# Altium project LCC.PrjPcb
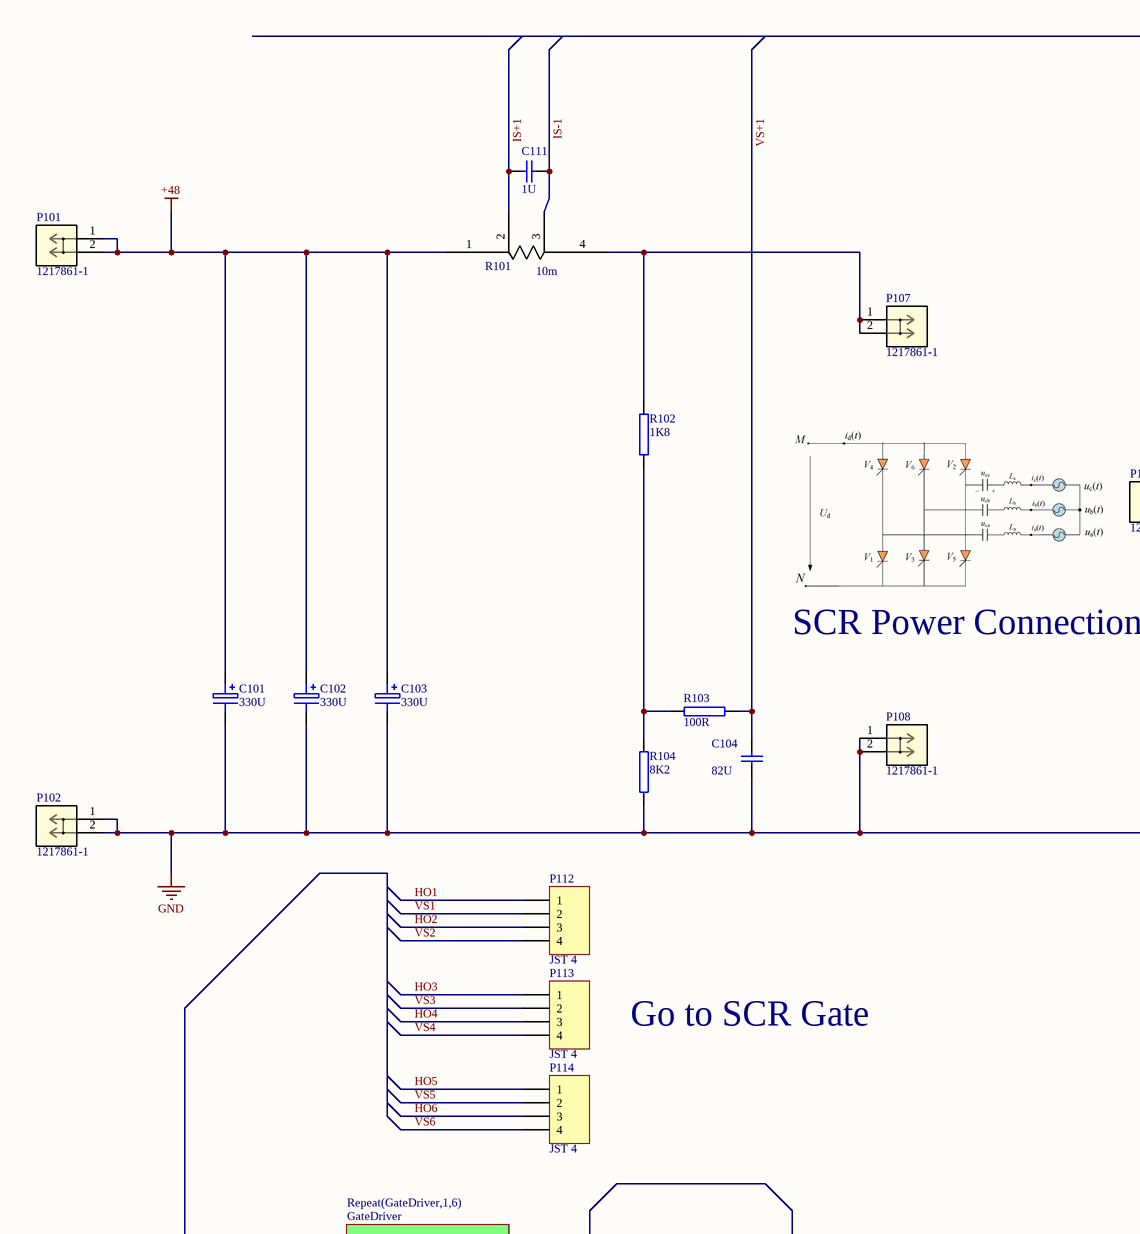
[diagram p0: main.SchDoc, top left]
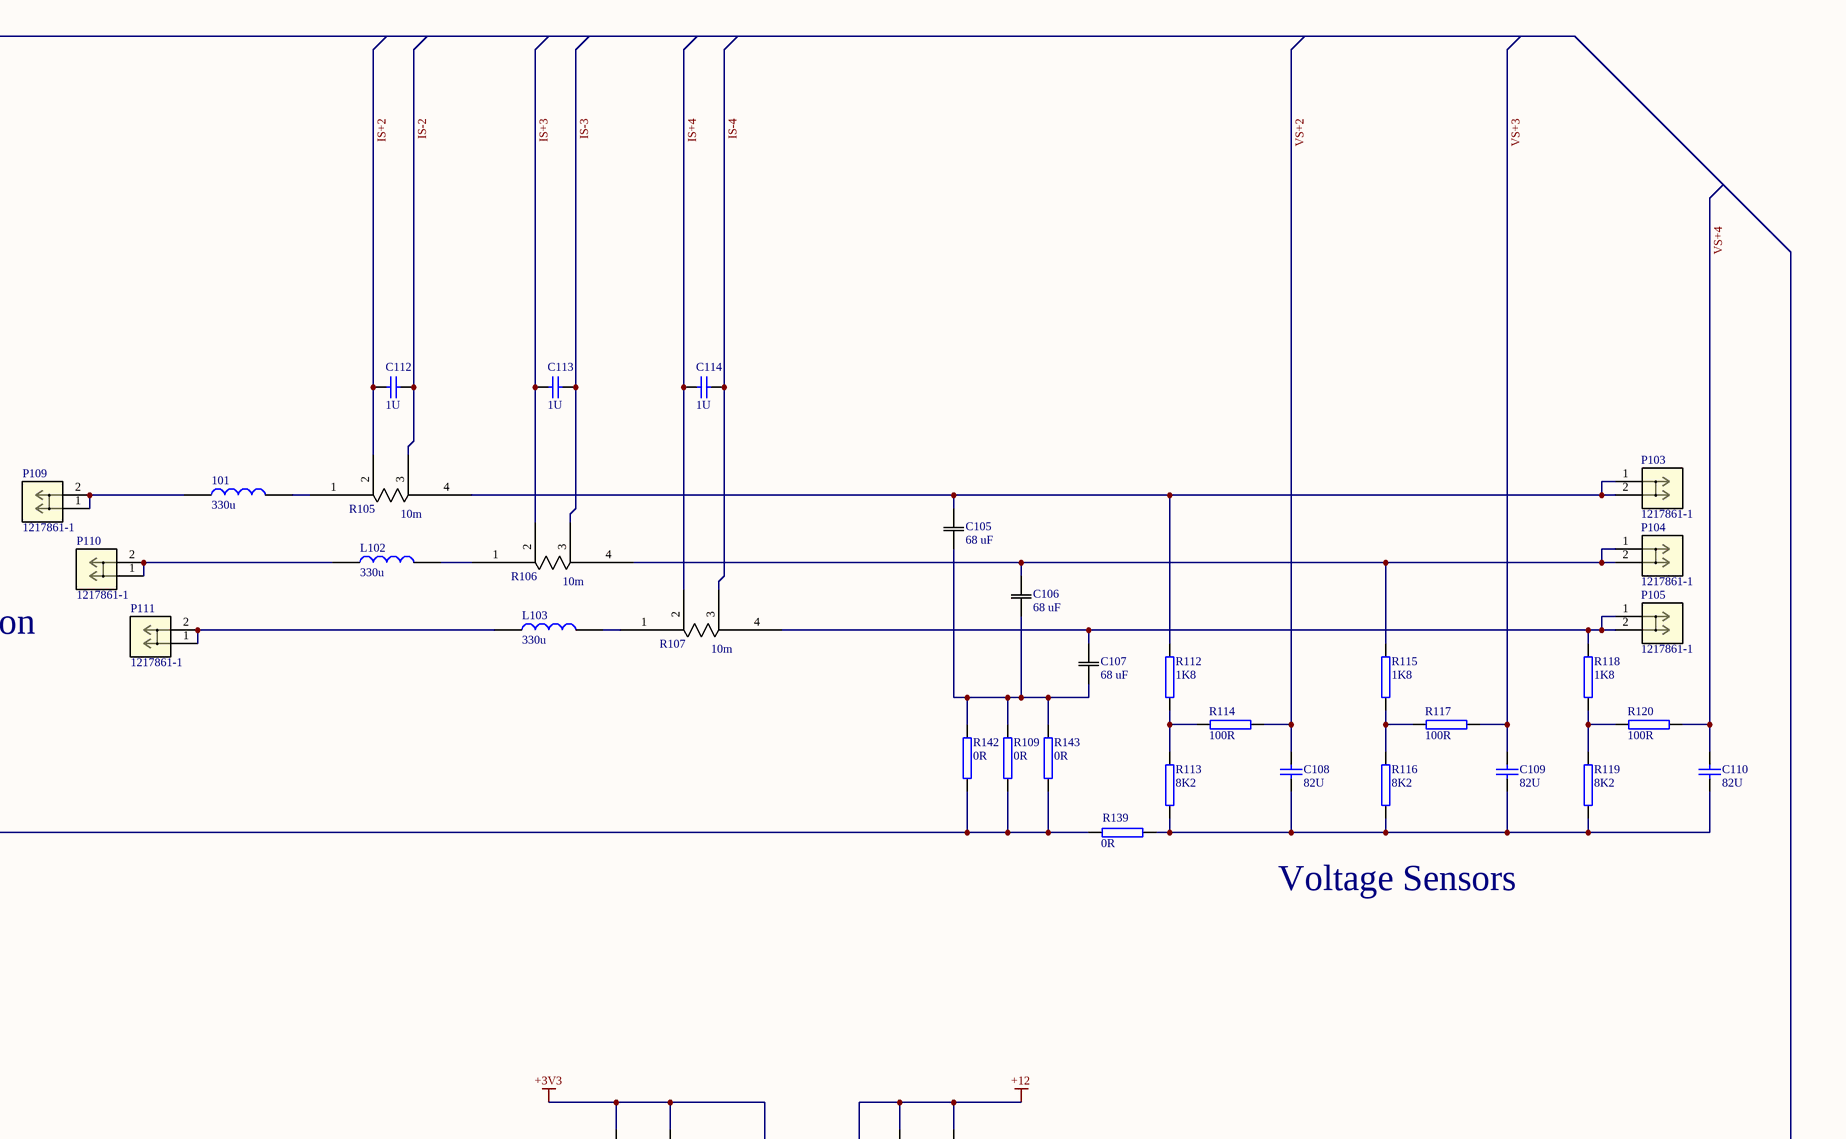
[diagram p1: main.SchDoc, top right]
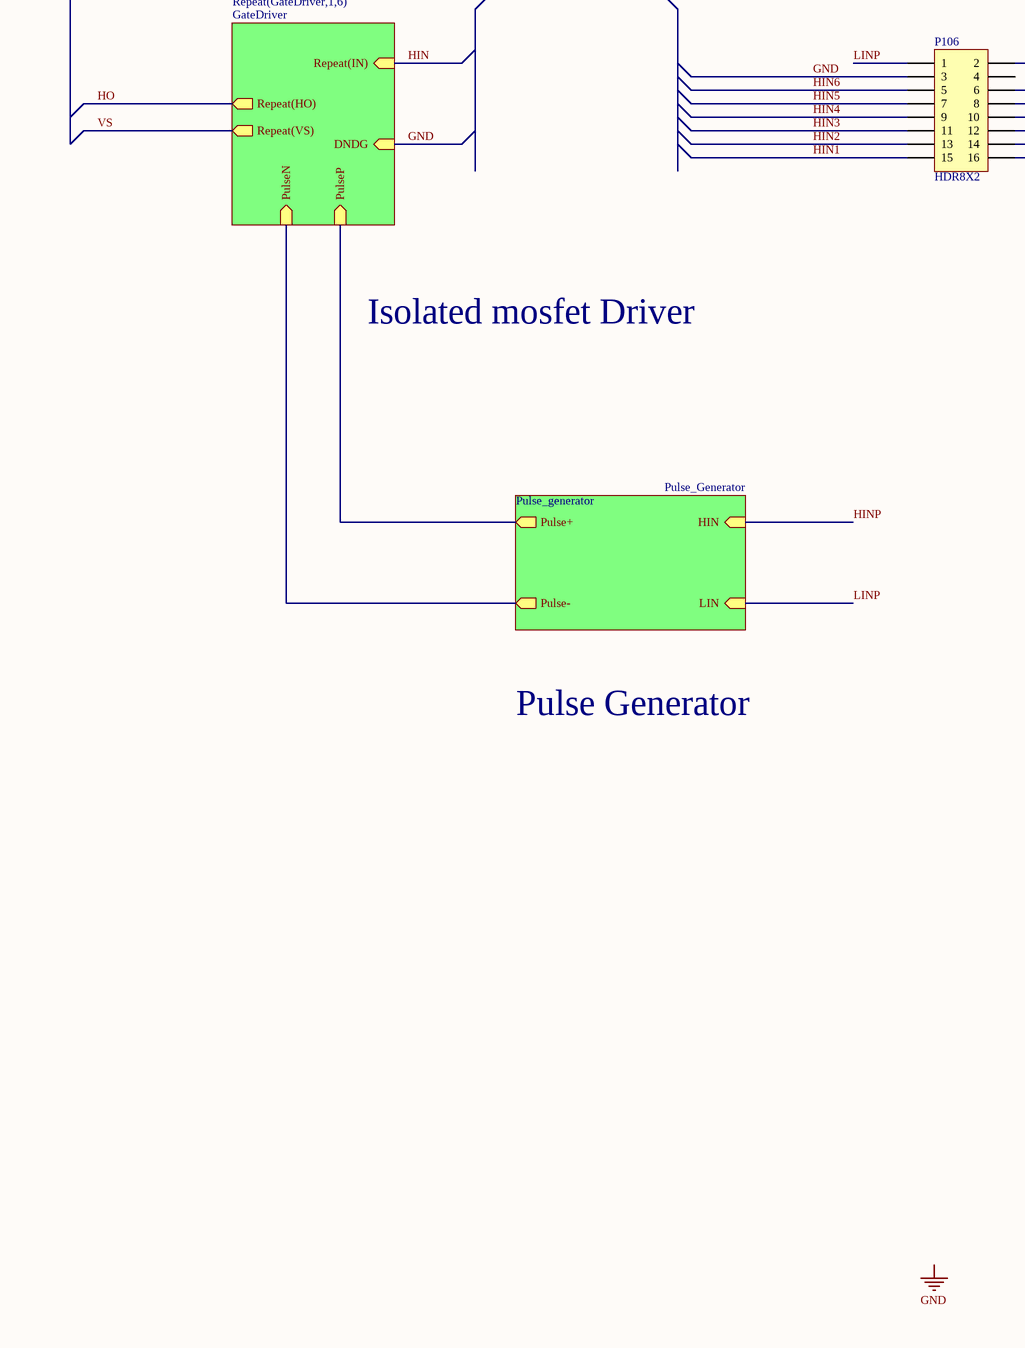
[diagram p2: main.SchDoc, bottom left]
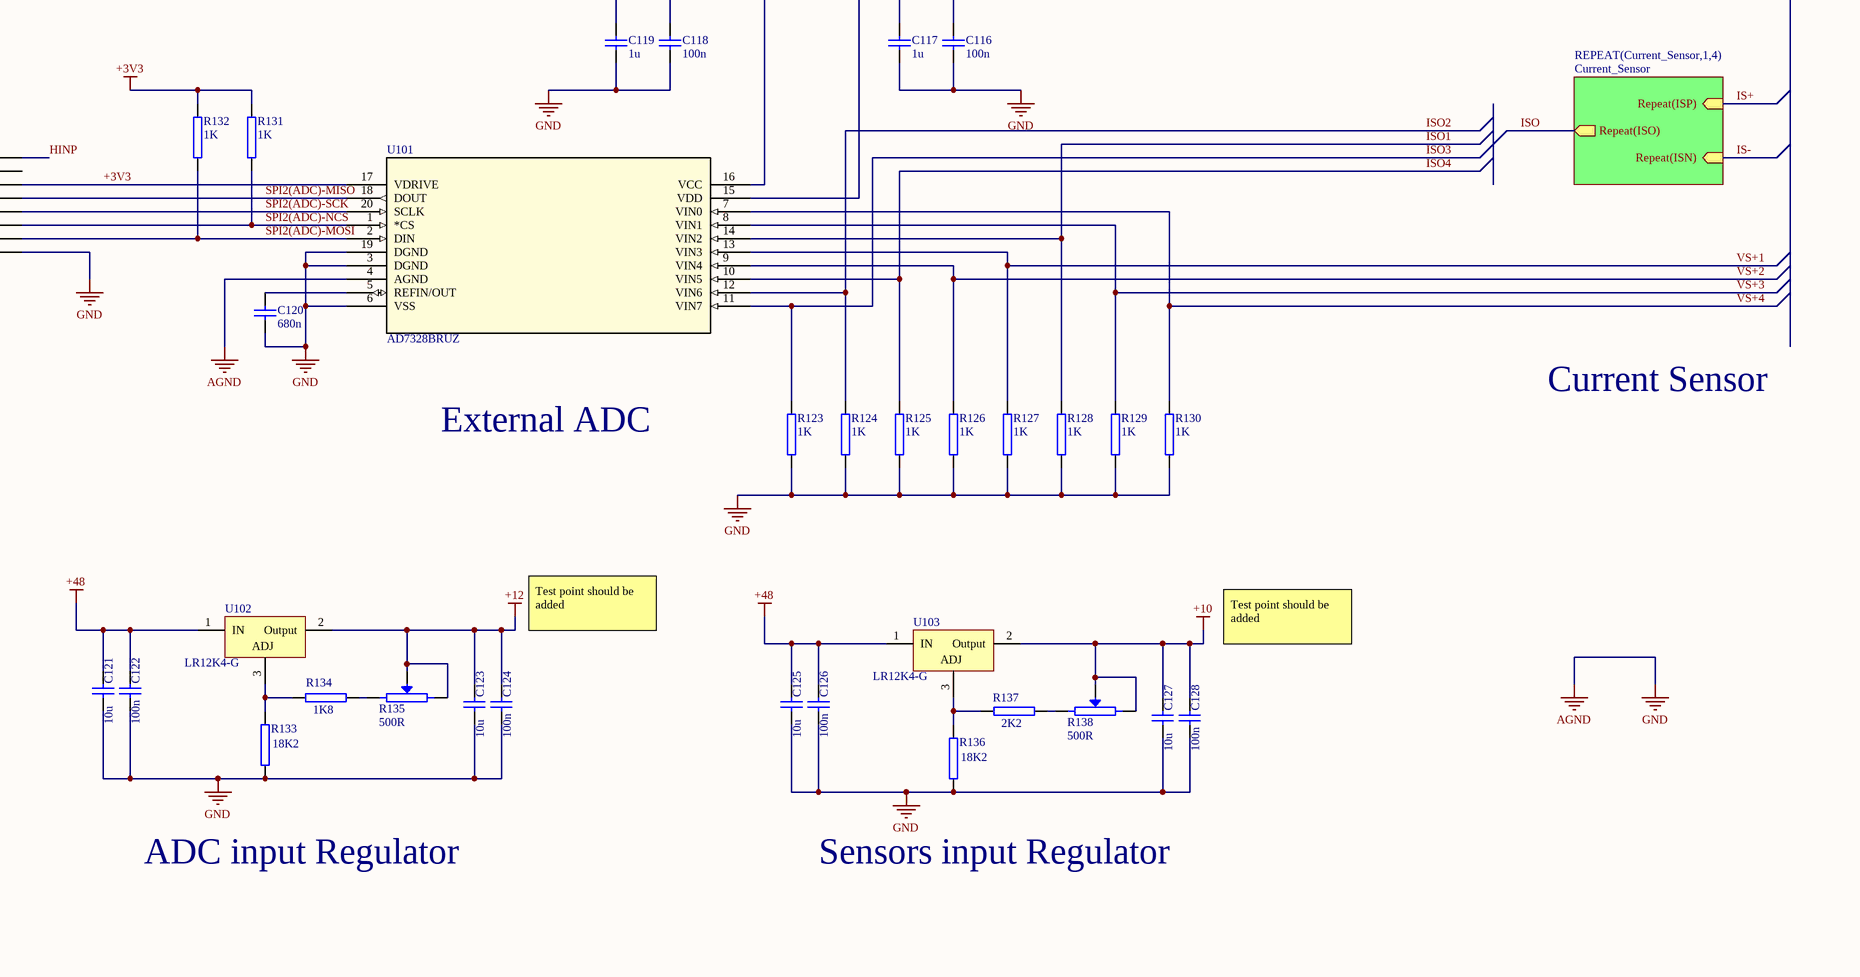
[diagram p3: main.SchDoc, bottom right]
4 sheets, 172 parts. Net scope: hierarchical (ports join the sheet entries above them; power ports are global).
Board file: Hellani_LCC_PCB.PcbDoc
Sheets:
  main.SchDoc
    Current_Sensor1 = Current_Sensor.SchDoc
    Current_Sensor2 = Current_Sensor.SchDoc
    Current_Sensor3 = Current_Sensor.SchDoc
    Current_Sensor4 = Current_Sensor.SchDoc
    GateDriver1 = GateDriver.SchDoc
    GateDriver2 = GateDriver.SchDoc
    GateDriver3 = GateDriver.SchDoc
    GateDriver4 = GateDriver.SchDoc
    GateDriver5 = GateDriver.SchDoc
    GateDriver6 = GateDriver.SchDoc
    Pulse_generator = Pulse_Generator.SchDoc

## Sheet main.SchDoc
size A2; SheetNumber: 1; SheetTotal: 4

### Parts
101  330u  [1140-331K-RC]
C101  330U  [CAPP300-600_AUT]
C102  330U  [CAPP300-600_AUT]
C103  330U  [CAPP300-600_AUT]
C104  82U  [CAP_1206]
C105  68 uF  [B32526R3686K000]
C106  68 uF  [B32526R3686K000]
C107  68 uF  [B32526R3686K000]
C108  82U  [CAP_1206]
C109  82U  [CAP_1206]
C110  82U  [CAP_1206]
C111  1U  [CAP_1206]
C112  1U  [CAP_1206]
C113  1U  [CAP_1206]
C114  1U  [CAP_1206]
C116  100n  [CAP_1206]
C117  1u  [CAP_1206]
C118  100n  [CAP_1206]
C119  1u  [CAP_1206]
C120  680n  [CAP_1206]
C121  10u  [CAP_1206]
C122  100n  [CAP_1206]
C123  10u  [CAP_1206]
C124  100n  [CAP_1206]
C125  10u  [CAP_1206]
C126  100n  [CAP_1206]
C127  10u  [CAP_1206]
C128  100n  [CAP_1206]
L102  330u  [1140-331K-RC]
L103  330u  [1140-331K-RC]
P101  1217861-1  [CONN_1217861-1_TEC]
P102  1217861-1  [CONN_1217861-1_TEC]
P103  1217861-1  [CONN_1217861-1_TEC]
P104  1217861-1  [CONN_1217861-1_TEC]
P105  1217861-1  [CONN_1217861-1_TEC]
P106  HDR8X2  [HDR2X8_AUT]
P107  1217861-1  [CONN_1217861-1_TEC]
P108  1217861-1  [CONN_1217861-1_TEC]
P109  1217861-1  [CONN_1217861-1_TEC]
P110  1217861-1  [CONN_1217861-1_TEC]
P111  1217861-1  [CONN_1217861-1_TEC]
P112  JST 4  [PA-4]
P113  JST 4  [PA-4]
P114  JST 4  [PA-4]
R101  10m  [WSL3673R_002-01]
R102  1K8  [RES_1206]
R103  100R  [RES_1206]
R104  8K2  [RES_1206]
R105  10m  [WSL3673R_002-01]
R106  10m  [WSL3673R_002-01]
R107  10m  [WSL3673R_002-01]
R109  0R  [RES_1206]
R112  1K8  [RES_1206]
R113  8K2  [RES_1206]
R114  100R  [RES_1206]
R115  1K8  [RES_1206]
R116  8K2  [RES_1206]
R117  100R  [RES_1206]
R118  1K8  [RES_1206]
R119  8K2  [RES_1206]
R120  100R  [RES_1206]
R123  1K  [RES_1206]
R124  1K  [RES_1206]
R125  1K  [RES_1206]
R126  1K  [RES_1206]
R127  1K  [RES_1206]
R128  1K  [RES_1206]
R129  1K  [RES_1206]
R130  1K  [RES_1206]
R131  1K  [RES_1206]
R132  1K  [RES_1206]
R133  18K2  [RES_1206]
R134  1K8  [RES_1206]
R135  500R  [3296W]
R136  18K2  [RES_1206]
R137  2K2  [RES_1206]
R138  500R  [3296W]
R139  0R  [RES_1206]
R142  0R  [RES_1206]
R143  0R  [RES_1206]
U101  AD7328BRUZ  [TSSOP20_44]
U102  LR12K4-G  [D PAK (TO-252-3)]
U103  LR12K4-G  [D PAK (TO-252-3)]

### Sub-sheets
Pulse_generator = Pulse_Generator: HIN (in), LIN (in), Pulse+ (out), Pulse- (out)
REPEAT(Current_Sensor,1,4) = Current_Sensor: Repeat(ISP) (in), Repeat(ISN) (in), Repeat(ISO) (out)
Repeat(GateDriver,1,6) = GateDriver: PulseN (in), PulseP (in), DNDG (in), Repeat(HO) (out), Repeat(IN) (in), Repeat(VS) (out)

### Nets
+3V3: C118.2 C119.2 P106.6 R131.2 R132.2 U101.16(VCC) U101.17(VDRIVE)
+10: C127.2 C128.2 R138.2(BOT) R138.W(TAP) U103.2(Output)
+12: C116.2 C117.2 C123.2 C124.2 R135.2(BOT) R135.W(TAP) U101.15(VDD) U102.2(Output)
+48: C101.1 C102.1 C103.1 C121.2 C122.2 C125.2 C126.2 P101.1 P101.2 R101.1 U102.1(IN) U103.1(IN)
GND: C101.2 C102.2 C103.2 C104.1 C116.1 C117.1 C118.1 C119.1 C120.1 C121.1 C122.1 C123.1 C124.1 C125.1 C126.1 C127.1 C128.1 P102.1 P102.2 P106.3 P106.16 P108.1 P108.2 R104.1 R109.2 R123.1 R124.1 R125.1 R126.1 R127.1 R128.1 R129.1 R130.1 R133.1 R136.1 R139.1 R142.1 R143.2 U101.3(DGND) U101.4(AGND) U101.6(VSS) U101.19(DGND) ; sheet Repeat(GateDriver,1,6)/DNDG  [also labelled AGND]
HIN: sheet Repeat(GateDriver,1,6)/Repeat(IN)
HIN1: P106.15
HIN2: P106.13
HIN3: P106.11
HIN4: P106.9
HIN5: P106.7
HIN6: P106.5
HINP: P106.2 ; sheet Pulse_generator/HIN
HN: sheet Repeat(GateDriver,1,6)/PulseN, sheet Pulse_generator/Pulse-
HO: sheet Repeat(GateDriver,1,6)/Repeat(HO)
HO1: P112.1
HO2: P112.3
HO3: P113.1
HO4: P113.3
HO5: P114.1
HO6: P114.3
IS+: sheet REPEAT(Current_Sensor,1,4)/Repeat(ISP)
IS+1: C111.2 R101.2
IS+2: C112.2 R105.2
IS+3: C113.2 R106.2
IS+4: C114.2 R107.2
IS-: sheet REPEAT(Current_Sensor,1,4)/Repeat(ISN)
IS-1: C111.1 R101.3
IS-2: C112.1 R105.3
IS-3: C113.1 R106.3
IS-4: C114.1 R107.3
ISO: sheet REPEAT(Current_Sensor,1,4)/Repeat(ISO)
ISO1: R128.2 U101.14(VIN2)
ISO2: R124.2 U101.12(VIN6)
ISO3: R123.2 U101.11(VIN7)
ISO4: R125.2 U101.10(VIN5)
LINP: P106.1 ; sheet Pulse_generator/LIN
SPI2(ADC)-MISO: P106.8 U101.18(DOUT)
SPI2(ADC)-MOSI: P106.14 R132.1 U101.2(DIN)
SPI2(ADC)-NCS: P106.12 R131.1 U101.1(*CS)
SPI2(ADC)-SCK: P106.10 U101.20(SCLK)
VS: sheet Repeat(GateDriver,1,6)/Repeat(VS)
VS1: P112.2
VS2: P112.4
VS3: P113.2
VS4: P113.4
VS5: P114.2
VS6: P114.4
VS+1: C104.2 R103.1 R127.2 U101.13(VIN3)
VS+2: C108.2 R114.1 R126.2 U101.9(VIN4)
VS+3: C109.2 R117.1 R129.2 U101.8(VIN1)
VS+4: C110.2 R120.1 R130.2 U101.7(VIN0)
Net101_1: 101.1 P109.1 P109.2
Net101_2: 101.2 R105.1
NetC105_1: C105.1 C106.1 C107.1 R109.1 R142.2 R143.1
NetC105_2: C105.2 P103.1 P103.2 R105.4 R112.2
NetC106_2: C106.2 P104.1 P104.2 R106.4 R115.2
NetC107_2: C107.2 P105.1 P105.2 R107.4 R118.2
NetC108_1: C108.1 C109.1 C110.1 R113.1 R116.1 R119.1 R139.2
NetC120_2: C120.2 U101.5(REFIN/OUT)
NetC406_2: sheet Repeat(GateDriver,1,6)/PulseP, sheet Pulse_generator/Pulse+
NetL102_1: L102.1 P110.1 P110.2
NetL102_2: L102.2 R106.1
NetL103_1: L103.1 P111.1 P111.2
NetL103_2: L103.2 R107.1
NetP107_1: P107.1 P107.2 R101.4 R102.2
NetR102_1: R102.1 R103.2 R104.2
NetR112_1: R112.1 R113.2 R114.2
NetR115_1: R115.1 R116.2 R117.2
NetR118_1: R118.1 R119.2 R120.2
NetR133_2: R133.2 R134.2 U102.3(ADJ)
NetR134_1: R134.1 R135.1(TOP)
NetR136_2: R136.2 R137.2 U103.3(ADJ)
NetR137_1: R137.1 R138.1(TOP)

Not connected (* = marked no-connect by the designer): P106 4

### Notes on the sheet
- SCR Power Connection
- Voltage Sensors
- Go to SCR Gate
- Isolated mosfet Driver
- External ADC
- Current Sensor
- Test point should be added
- Pulse Generator
- ADC input Regulator
- Sensors input Regulator
- Labels drawn without touching a wire or pin: GND

### Library data of the parts
101 L102 L103 = 1140-331K-RC: Power Inductors - Leaded 330uH 10% / https://nz.mouser.com/ProductDetail/Bourns/1140-331K-RC?qs=wiQ7G1Lt8gwP8A01VI%2FcoA%3D%3D; ComponentLink1Description: New link; ComponentLink1URL: https://nz.mouser.com/ProductDetail/Bourns/1140-331K-RC?qs=wiQ7G1Lt8gwP8A01VI%2FcoA%3D%3D
C101-C103 = CAPP300-600: Polarized Aluminum Capacitor, Through Hole, Pitch 300mil, Body 600mil (Dia)
C104 C108-C114 C116-C128 = CAPN 1206: Non Polarized Capacitor, SMD, 1206
C105-C107 = B32526R3686K000: 68 µF Film Capacitor 160V 250V Polyester, Polyethylene Terephthalate (PET), Metallized Radial / https://www.digikey.co.nz/en/products/detail/epcos-tdk-electronics/B32526R3686K000/3490213; ComponentLink1Description: New link; ComponentLink1URL: https://www.digikey.co.nz/en/products/detail/epcos-tdk-electronics/B32526R3686K000/3490213
P101-P105 P107-P111 = 1217861-1: 250 FASTON,PCB TAB,TCBR / https://tinyurl.com/5c2arff3 / https://www.digikey.co.nz/en/products/detail/te-connectivity-amp-connectors/1217861-1/2233479?_gl=1*5eokag*_up*MQ..*_gs*MQ..&gclid=EAIaIQobChMI8b7VmffHjwMVDh6DAx24XBEhEAAYASAAEgLCEPD_BwE&gclsrc=aw.ds&gbraid=0AAAAADrbLlg332VqylSF3zuB8x7hQ-0VQ
P106 = HDR8X2: Header, 8-Pin, Dual row, 2.54mm Pitch, Straight; Supplier 1: Farnell; Supplier Part Number 1: 9733620
P112-P114 = JST PA Header 4: JST PA Header, 4-Pin, Pitch 2mm; Supplier 1: Farnell; Supplier Part Number 1: 1830737
R101 R105-R107 = WSL3673R-01: Current Shunt / Kelvin 4W 0.002- 0.01
R102-R104 R109 R112-R120 R123-R134 R136 R137 R139 R142 R143 = Resistor 1206: Resistor, SMD, 1206
R135 R138 = 3296W-1-104LF: 3296W Series, 3/8 ” Square Potentiometer, 100k, 10%,  0.5 Watts, Multi Turn / Part #: PV36W501C01B00; Supplier 1: Farnell; Supplier Part Number 1: 9353194
U101 = AD7328BRUZ: ADC 12 Bit / Package TSSOP20
U102 U103 = LR12K4-G: Adj Positive Regulator / Linear. 12V dropout V. / 2W

## Sheet Current_Sensor.SchDoc
size A3; SheetNumber: 2; SheetTotal: 4
Used 4 times, as channels Current_Sensor1, Current_Sensor2, Current_Sensor3, Current_Sensor4. Parts and nets are listed once, with the designators drawn on the sheet.
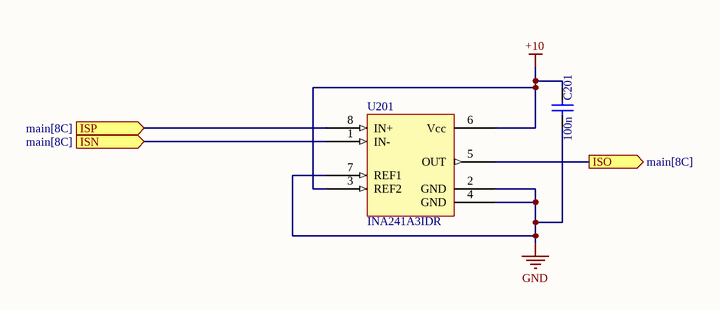
[diagram p4: Current_Sensor.SchDoc]

### Parts
C201  100n  [CAP_1206]
U201  INA241A3IDR  [SOIC8_M]

### Ports
ISN (in, see main[8C]), ISO (out, see main[8C]), ISP (in, see main[8C])

### Nets
+10: C201.2 U201.3(REF2) U201.6(Vcc)
GND: C201.1 U201.2(GND) U201.4(GND) U201.7(REF1)
ISN: U201.1(IN-) ; port ISN
ISO: U201.5(OUT) ; port ISO
ISP: U201.8(IN+) ; port ISP

### Channels
Current_Sensor1: designators end in A; ports ISN=IS-1 ISO=ISO1 ISP=IS+1
Current_Sensor2: designators end in B; ports ISN=IS-2 ISO=ISO2 ISP=IS+2
Current_Sensor3: designators end in C; ports ISN=IS-3 ISO=ISO3 ISP=IS+3
Current_Sensor4: designators end in D; ports ISN=IS-4 ISO=ISO4 ISP=IS+4

### Library data of the parts
C201 = CAPN 1206: Non Polarized Capacitor, SMD, 1206
U201 = INA241A3IDR: Current Sense Amplifier 1 Circuit Single-Ended 8-SOIC

## Sheet GateDriver.SchDoc
size A3; SheetNumber: 3; SheetTotal: 4
Used 6 times, as channels GateDriver1, GateDriver2, GateDriver3, GateDriver4, GateDriver5, GateDriver6. Parts and nets are listed once, with the designators drawn on the sheet.
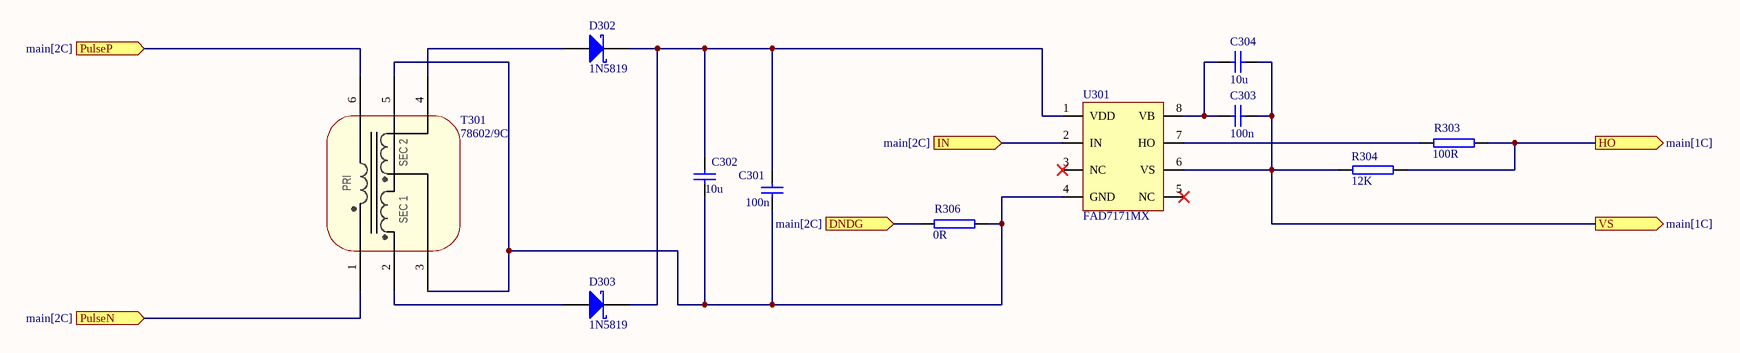
[diagram p5: GateDriver.SchDoc]

### Parts
C301  100n  [CAP_1206]
C302  10u  [CAP_1206]
C303  100n  [RAD-0.2_AUT]
C304  10u  [CAP_1206]
D302  1N5819  [DIODE0.4_AUT]
D303  1N5819  [DIODE0.4_AUT]
R303  100R  [RES_1206]
R304  12K  [RES_1206]
R306  0R  [RES_1206]
T301  78602/9C  [DIP6W_AUT]
U301  FAD7171MX  [SOIC8-M]

### Ports
DNDG (in, see main[2C]), HO (out, see main[1C]), IN (in, see main[2C]), PulseN (in, see main[2C]), PulseP (in, see main[2C]), VS (out, see main[1C])

### Nets
DNDG: R306.2 ; port DNDG
HO: R303.2 R304.1 ; port HO
IN: U301.2(IN) ; port IN
PulseN: T301.1(Pri_1) ; port PulseN
PulseP: T301.6(Pri2) ; port PulseP
VS: C303.2 C304.1 R304.2 U301.6(VS) ; port VS
NetC301_1: C301.1 C302.1 R306.1 T301.3(Sec1_2) T301.5(Sec1_2) U301.4(GND)
NetC301_2: C301.2 C302.2 D302.K D303.K U301.1(VDD)
NetC303_1: C303.1 C304.2 U301.8(VB)
NetD302_A: D302.A T301.4(Sec2_2)
NetD303_A: D303.A T301.2(Sec1_1)
NetR303_1: R303.1 U301.7(HO)

Not connected (* = marked no-connect by the designer): U301 3(NC)* 5(NC)*

### Channels
GateDriver1: designators end in A; ports DNDG=GND HO=HO1 IN=HIN1 PulseN=HN PulseP=NetC406_2 VS=VS1
GateDriver2: designators end in B; ports DNDG=GND HO=HO2 IN=HIN2 PulseN=HN PulseP=NetC406_2 VS=VS2
GateDriver3: designators end in C; ports DNDG=GND HO=HO3 IN=HIN3 PulseN=HN PulseP=NetC406_2 VS=VS3
GateDriver4: designators end in D; ports DNDG=GND HO=HO4 IN=HIN4 PulseN=HN PulseP=NetC406_2 VS=VS4
GateDriver5: designators end in E; ports DNDG=GND HO=HO5 IN=HIN5 PulseN=HN PulseP=NetC406_2 VS=VS5
GateDriver6: designators end in F; ports DNDG=GND HO=HO6 IN=HIN6 PulseN=HN PulseP=NetC406_2 VS=VS6

### Notes on the sheet
- (in symbol 78602/9C) SEC 2; PRI; SEC 1

### Library data of the parts
C301 C302 C304 = CAPN 1206: Non Polarized Capacitor, SMD, 1206
C303 = CAPN RAD0.2: Non Polarized Capacitor, Multilayer Ceramic Dipped Radial, Pitch 200mil
D302 D303 = 1N5819: Schottky Diode, 1A,40v; Supplier 1: Farnell; Supplier Part Number 1: 1017589
R303 R304 R306 = Resistor 1206: Resistor, SMD, 1206
T301 = 78602/9C: Pulse transformer 1:1:1
U301 = FAD7171MX: High-Side Gate Driver IC Non-Inverting PG-DSO-8 / 8-SOIC (0.154", 3.90mm Width) / https://www.digikey.co.nz/en/products/detail/onsemi/FAD7171MX/24627314

## Sheet Pulse_Generator.SchDoc
size A3; SheetNumber: 4; SheetTotal: 4
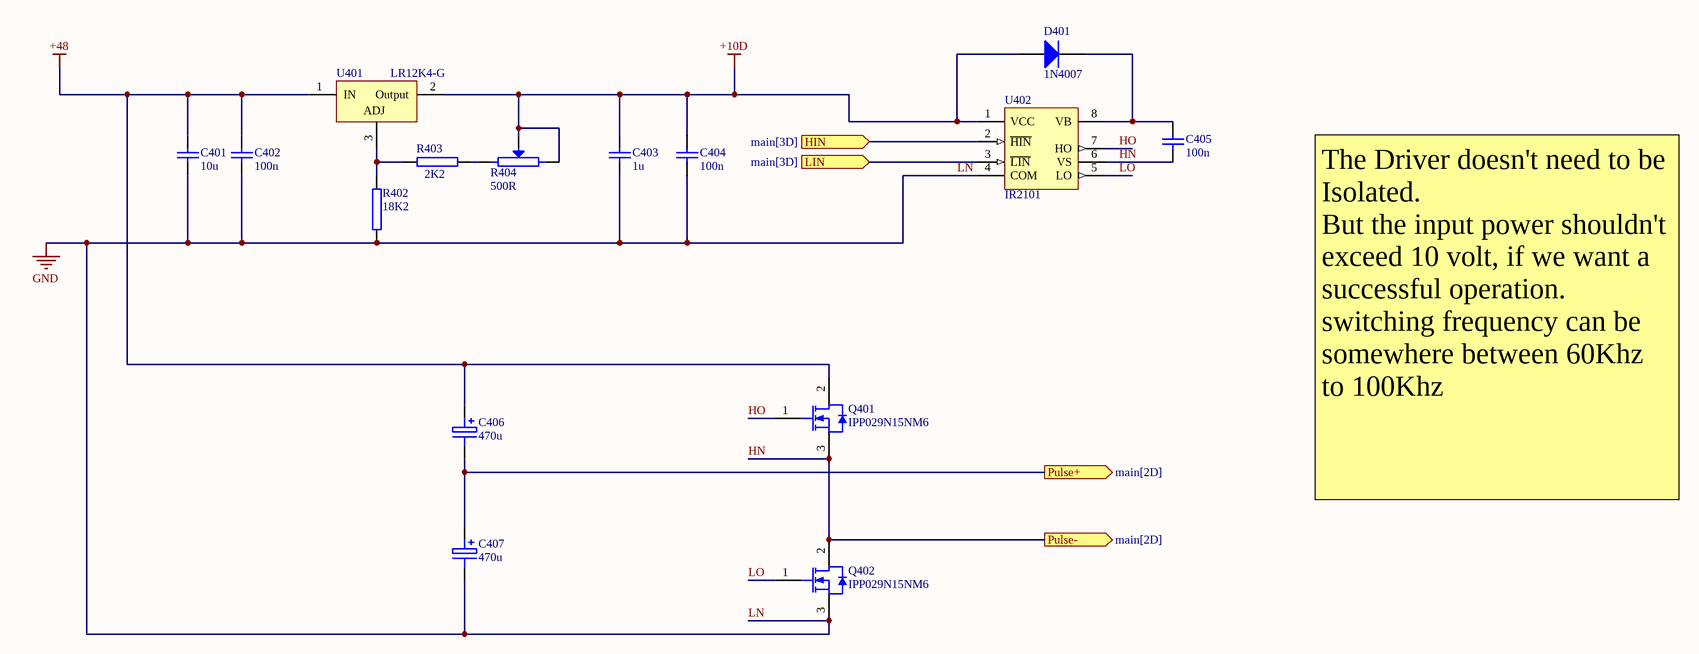
[diagram p6: Pulse_Generator.SchDoc]

### Parts
C401  10u  [CAP_1206]
C402  100n  [CAP_1206]
C403  1u  [CAP_1206]
C404  100n  [CAP_1206]
C405  100n  [RAD-0.2_AUT]
C406  470u  [CAPP300-600_AUT]
C407  470u  [CAPP300-600_AUT]
D401  1N4007  [DIODE0.4_AUT]
Q401  IPP029N15NM6  [TO-220V]
Q402  IPP029N15NM6  [TO-220V]
R402  18K2  [RES_1206]
R403  2K2  [RES_1206]
R404  500R  [3296W]
U401  LR12K4-G  [D PAK (TO-252-3)]
U402  IR2101  [DIP8_AUT]

### Ports
HIN (in, see main[3D]), LIN (in, see main[3D]), Pulse+ (out, see main[2D]), Pulse- (out, see main[2D])

### Nets
+10D: C403.2 C404.2 D401.A R404.2(BOT) R404.W(TAP) U401.2(Output) U402.1(VCC)
+48: C401.2 C402.2 C406.1 Q401.2(D) U401.1(IN)
GND: C401.1 C402.1 C403.1 C404.1 C407.2 Q402.3(S) R402.1 U402.4(COM)  [also labelled LN]
HINP: U402.2(~{HIN}) ; port HIN
HN: C405.1 Q401.3(S) Q402.2(D) U402.6(VS) ; port Pulse-
HO: Q401.1(G) U402.7(HO)
LINP: U402.3(~{LIN}) ; port LIN
LO: Q402.1(G) U402.5(LO)
NetC405_2: C405.2 D401.K U402.8(VB)
NetC406_2: C406.2 C407.1 ; port Pulse+
NetR402_2: R402.2 R403.2 U401.3(ADJ)
NetR403_1: R403.1 R404.1(TOP)

### Notes on the sheet
- The Driver doesn't need to be Isolated.
  But the input power shouldn't exceed 10 volt, if we want a successful operation.
  switching frequency can be somewhere between 60Khz to 100Khz

### Library data of the parts
C401-C404 = CAPN 1206: Non Polarized Capacitor, SMD, 1206
C405 = CAPN RAD0.2: as C303 on sheet GateDriver
C406 C407 = CAPP300-600: as C101 on sheet main
D401 = 1N4007: Diode, Standard, 1A, 1000v; Supplier 1: Farnell; Supplier Part Number 1: 9549129
Q401 = FQP65N06: Insulated-Gate Field-Effect Transistor (IGFET), N-Channel, Enhancement, Body Diode, Pin 1 Gate, 2 Drain, 3 Source, 3 Pins- Through Hole TO-220-3
Q402 = FQP65N06: Insulated-Gate Field-Effect Transistor (IGFET), N-Channel, Enhancement, Body Diode, Pin 1 Gate, 2 Drain, 3 Source, 3 Pins - Through Hole TO-220-3
R402 R403 = Resistor 1206: Resistor, SMD, 1206
R404 = 3296W-1-104LF: as R135 on sheet main; Supplier 1: Farnell; Supplier Part Number 1: 9353194
U401 = LR12K4-G: as U102 on sheet main
U402 = IR2101_DIP: Half - Bridge Driver, MOSFET/IGBT, DIP8; Supplier 1: Farnell; Supplier Part Number 1: 8638829

## Nets that join several sheets
+10: main (5 pins), Current_Sensor1 (C201A.2 U201A.3 U201A.6), Current_Sensor2 (C201B.2 U201B.3 U201B.6), Current_Sensor3 (C201C.2 U201C.3 U201C.6), Current_Sensor4 (C201D.2 U201D.3 U201D.6)
+48: main (12 pins), Pulse_Generator (5 pins)
GND: main (42 pins), Current_Sensor1 (C201A.1 U201A.2 U201A.4 U201A.7), Current_Sensor2 (C201B.1 U201B.2 U201B.4 U201B.7), Current_Sensor3 (C201C.1 U201C.2 U201C.4 U201C.7), Current_Sensor4 (C201D.1 U201D.2 U201D.4 U201D.7), GateDriver1 (R306A.2), GateDriver2 (R306B.2), GateDriver3 (R306C.2), GateDriver4 (R306D.2), GateDriver5 (R306E.2), GateDriver6 (R306F.2), Pulse_Generator (8 pins)
HIN1: main (P106.15), GateDriver1 (U301A.2)
HIN2: main (P106.13), GateDriver2 (U301B.2)
HIN3: main (P106.11), GateDriver3 (U301C.2)
HIN4: main (P106.9), GateDriver4 (U301D.2)
HIN5: main (P106.7), GateDriver5 (U301E.2)
HIN6: main (P106.5), GateDriver6 (U301F.2)
HINP: main (P106.2), Pulse_Generator (U402.2)
HN: GateDriver1 (T301A.1), GateDriver2 (T301B.1), GateDriver3 (T301C.1), GateDriver4 (T301D.1), GateDriver5 (T301E.1), GateDriver6 (T301F.1), Pulse_Generator (C405.1 Q401.3 Q402.2 U402.6)
HO1: main (P112.1), GateDriver1 (R303A.2 R304A.1)
HO2: main (P112.3), GateDriver2 (R303B.2 R304B.1)
HO3: main (P113.1), GateDriver3 (R303C.2 R304C.1)
HO4: main (P113.3), GateDriver4 (R303D.2 R304D.1)
HO5: main (P114.1), GateDriver5 (R303E.2 R304E.1)
HO6: main (P114.3), GateDriver6 (R303F.2 R304F.1)
IS+1: main (C111.2 R101.2), Current_Sensor1 (U201A.8)
IS+2: main (C112.2 R105.2), Current_Sensor2 (U201B.8)
IS+3: main (C113.2 R106.2), Current_Sensor3 (U201C.8)
IS+4: main (C114.2 R107.2), Current_Sensor4 (U201D.8)
IS-1: main (C111.1 R101.3), Current_Sensor1 (U201A.1)
IS-2: main (C112.1 R105.3), Current_Sensor2 (U201B.1)
IS-3: main (C113.1 R106.3), Current_Sensor3 (U201C.1)
IS-4: main (C114.1 R107.3), Current_Sensor4 (U201D.1)
ISO1: main (R128.2 U101.14), Current_Sensor1 (U201A.5)
ISO2: main (R124.2 U101.12), Current_Sensor2 (U201B.5)
ISO3: main (R123.2 U101.11), Current_Sensor3 (U201C.5)
ISO4: main (R125.2 U101.10), Current_Sensor4 (U201D.5)
LINP: main (P106.1), Pulse_Generator (U402.3)
NetC406_2: GateDriver1 (T301A.6), GateDriver2 (T301B.6), GateDriver3 (T301C.6), GateDriver4 (T301D.6), GateDriver5 (T301E.6), GateDriver6 (T301F.6), Pulse_Generator (C406.2 C407.1)
VS1: main (P112.2), GateDriver1 (C303A.2 C304A.1 R304A.2 U301A.6)
VS2: main (P112.4), GateDriver2 (C303B.2 C304B.1 R304B.2 U301B.6)
VS3: main (P113.2), GateDriver3 (C303C.2 C304C.1 R304C.2 U301C.6)
VS4: main (P113.4), GateDriver4 (C303D.2 C304D.1 R304D.2 U301D.6)
VS5: main (P114.2), GateDriver5 (C303E.2 C304E.1 R304E.2 U301E.6)
VS6: main (P114.4), GateDriver6 (C303F.2 C304F.1 R304F.2 U301F.6)